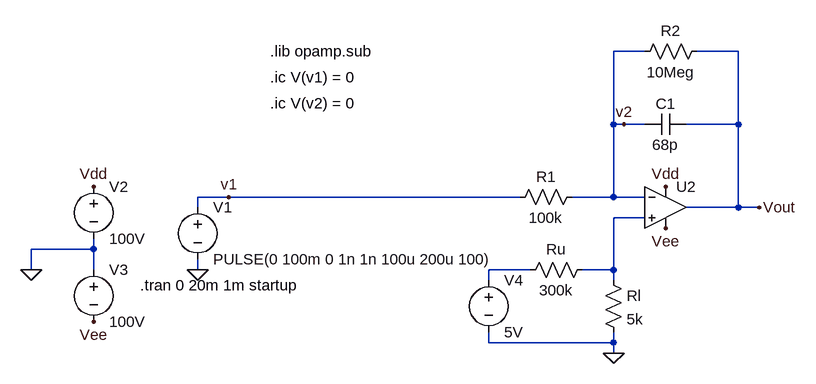
[diagram p0: schematic Integrator.asc]
Integrator.asc, the LTspice schematic file:
Version 4
SHEET 1 880 680
WIRE 272 0 224 0
WIRE 416 0 352 0
WIRE 224 112 224 0
WIRE 240 112 224 112
WIRE 272 112 240 112
WIRE 416 112 416 0
WIRE 416 112 336 112
WIRE -368 224 -416 224
WIRE 80 224 -368 224
WIRE 224 224 224 112
WIRE 224 224 160 224
WIRE 272 224 224 224
WIRE -416 240 -416 224
WIRE 416 240 416 112
WIRE 416 240 336 240
WIRE 448 240 416 240
WIRE 272 256 224 256
WIRE -576 304 -576 288
WIRE -576 304 -672 304
WIRE -672 336 -672 304
WIRE -576 336 -576 304
WIRE -416 336 -416 320
WIRE 96 336 32 336
WIRE 224 336 224 256
WIRE 224 336 176 336
WIRE 32 352 32 336
WIRE 224 352 224 336
WIRE 32 448 32 432
WIRE 224 448 224 432
WIRE 224 448 32 448
WIRE 224 464 224 448
FLAG 448 240 Vout
FLAG -416 336 0
FLAG -368 224 v1
FLAG 240 112 v2
FLAG -672 336 0
FLAG -576 208 Vdd
FLAG 304 208 Vdd
FLAG -576 416 Vee
FLAG 304 272 Vee
FLAG 224 464 0
SYMBOL res 176 208 R90
WINDOW 0 0 56 VBottom 2
WINDOW 3 32 56 VTop 2
SYMATTR InstName R1
SYMATTR Value 100k
SYMBOL cap 336 96 R90
WINDOW 0 0 32 VBottom 2
WINDOW 3 32 32 VTop 2
SYMATTR InstName C1
SYMATTR Value 68p
SYMBOL voltage -416 224 R0
WINDOW 123 0 0 Left 0
WINDOW 39 0 0 Left 0
SYMATTR InstName V1
SYMATTR Value PULSE(0 100m 0 1n 1n 100u 200u 100)
SYMBOL Opamps\\UniversalOpamp2 304 240 R0
SYMATTR InstName U2
SYMBOL voltage -576 192 R0
WINDOW 123 0 0 Left 0
WINDOW 39 0 0 Left 0
SYMATTR InstName V2
SYMATTR Value 100V
SYMBOL voltage -576 320 R0
WINDOW 123 0 0 Left 0
WINDOW 39 0 0 Left 0
SYMATTR InstName V3
SYMATTR Value 100V
SYMBOL res 256 16 R270
WINDOW 0 32 56 VTop 2
WINDOW 3 0 56 VBottom 2
SYMATTR InstName R2
SYMATTR Value 10Meg
SYMBOL res 192 320 R90
WINDOW 0 0 56 VBottom 2
WINDOW 3 32 56 VTop 2
SYMATTR InstName Ru
SYMATTR Value 300k
SYMBOL res 208 336 R0
SYMATTR InstName Rl
SYMATTR Value 5k
SYMBOL voltage 32 336 R0
SYMATTR InstName V4
SYMATTR Value 5V
TEXT -304 0 Left 2 !.lib opamp.sub
TEXT -504 360 Left 2 !.tran 0 20m 1m startup
TEXT -304 40 Left 2 !.ic V(v1) = 0
TEXT -304 80 Left 2 !.ic V(v2) = 0

The netlist it stands for:
* Integrator.asc
R1 v2 v1 100k
C1 Vout v2 68p
V1 v1 0 PULSE(0 100m 0 1n 1n 100u 200u 100)
XU2 N001 v2 Vdd Vee Vout level.2 Avol=1Meg GBW=10Meg Slew=10Meg ilimit=25m rail=0 Vos=0 phimargin=45 en=0 enk=0 in=0 ink=0 Rin=500Meg  ; pins IN+ IN- V+ V- OUT
V2 Vdd 0 100V
V3 0 Vee 100V
R2 v2 Vout 10Meg
Ru N001 N002 300k
Rl N001 0 5k
V4 N002 0 5V
.lib opamp.sub
.tran 0 20m 1m startup
.ic V(v1) = 0
.ic V(v2) = 0
.lib UniversalOpamps2.sub
.backanno
.end